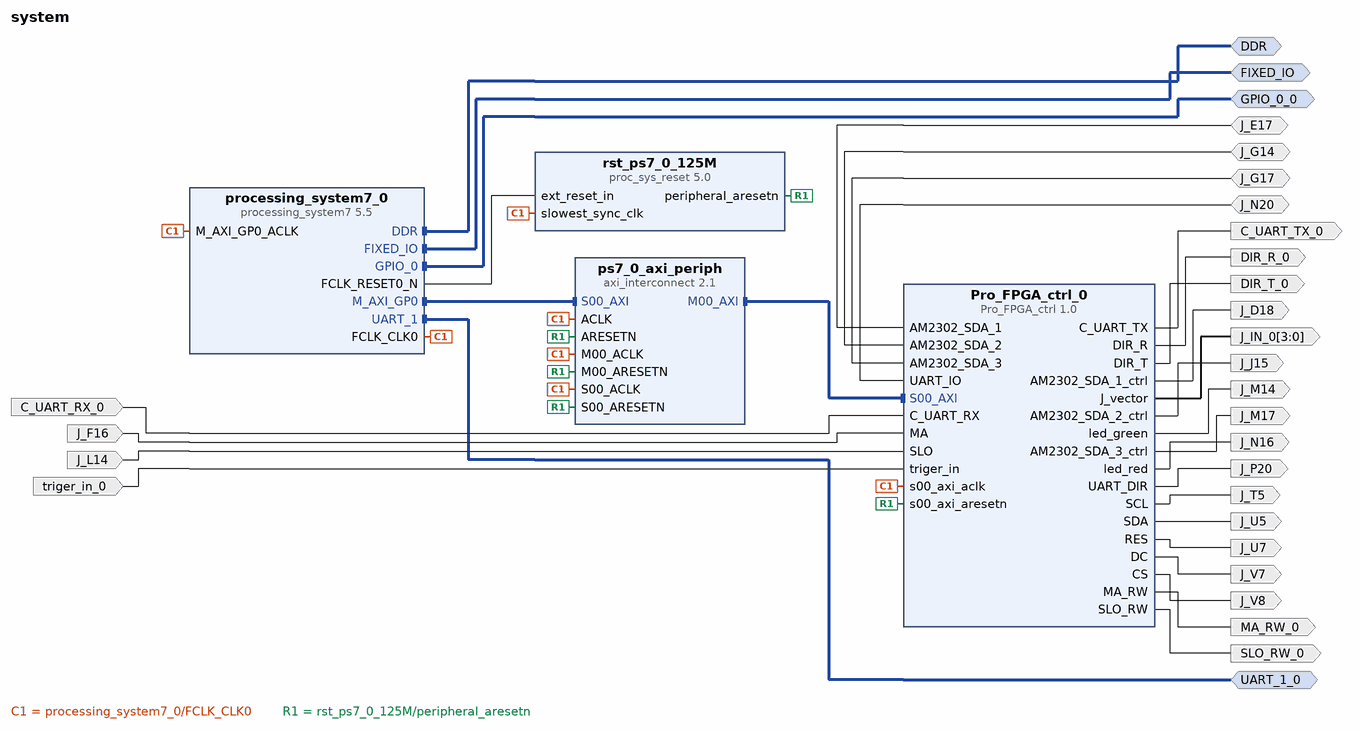
[diagram p0: block diagram of the top level]
# Vivado block design system, xc7z020clg400-2, Vivado 2018.3
create_bd_design system

create_bd_intf_port -mode Master -vlnv xilinx.com:interface:ddrx_rtl:1.0 DDR
create_bd_intf_port -mode Master -vlnv xilinx.com:display_processing_system7:fixedio_rtl:1.0 FIXED_IO
create_bd_intf_port -mode Master -vlnv xilinx.com:interface:uart_rtl:1.0 UART_1_0
create_bd_intf_port -mode Master -vlnv xilinx.com:interface:gpio_rtl:1.0 GPIO_0_0
create_bd_port -dir IO J_E17
create_bd_port -dir O J_D18
create_bd_port -dir IO J_G14
create_bd_port -dir O J_J15
create_bd_port -dir IO J_G17
create_bd_port -dir O J_M17
create_bd_port -dir O J_V8
create_bd_port -dir I C_UART_RX_0
create_bd_port -dir O C_UART_TX_0
create_bd_port -dir O J_V7
create_bd_port -dir O DIR_R_0
create_bd_port -dir O DIR_T_0
create_bd_port -dir O -from 3 -to 0 J_IN_0
create_bd_port -dir I J_F16
create_bd_port -dir O MA_RW_0
create_bd_port -dir O J_U7
create_bd_port -dir O J_T5
create_bd_port -dir O J_U5
create_bd_port -dir I J_L14
create_bd_port -dir O SLO_RW_0
create_bd_port -dir O J_P20
create_bd_port -dir IO J_N20
create_bd_port -dir O J_M14
create_bd_port -dir O J_N16
create_bd_port -dir I triger_in_0

create_bd_cell -type ip -vlnv xilinx.com:ip:processing_system7:5.5 processing_system7_0
set_property -dict [list \
  CONFIG.PCW_APU_PERIPHERAL_FREQMHZ 666.666666 \
  CONFIG.PCW_CPU_CPU_6X4X_MAX_RANGE 767 \
  CONFIG.PCW_ENET0_ENET0_IO {MIO 16 .. 27} \
  CONFIG.PCW_ENET0_GRP_MDIO_ENABLE 1 \
  CONFIG.PCW_ENET0_GRP_MDIO_IO {MIO 52 .. 53} \
  CONFIG.PCW_ENET0_PERIPHERAL_ENABLE 1 \
  CONFIG.PCW_FCLK_CLK0_BUF FALSE \
  CONFIG.PCW_FPGA0_PERIPHERAL_FREQMHZ 125 \
  CONFIG.PCW_FPGA1_PERIPHERAL_FREQMHZ 125 \
  CONFIG.PCW_GPIO_EMIO_GPIO_ENABLE 1 \
  CONFIG.PCW_GPIO_EMIO_GPIO_IO 1 \
  CONFIG.PCW_GPIO_EMIO_GPIO_WIDTH 1 \
  CONFIG.PCW_GPIO_MIO_GPIO_ENABLE 0 \
  CONFIG.PCW_PERIPHERAL_BOARD_PRESET None \
  CONFIG.PCW_PRESET_BANK1_VOLTAGE {LVCMOS 1.8V} \
  CONFIG.PCW_QSPI_GRP_SINGLE_SS_ENABLE 1 \
  CONFIG.PCW_QSPI_GRP_SINGLE_SS_IO {MIO 1 .. 6} \
  CONFIG.PCW_QSPI_PERIPHERAL_ENABLE 1 \
  CONFIG.PCW_QSPI_QSPI_IO {MIO 1 .. 6} \
  CONFIG.PCW_SD0_GRP_CD_ENABLE 0 \
  CONFIG.PCW_SD0_GRP_WP_ENABLE 0 \
  CONFIG.PCW_SD0_PERIPHERAL_ENABLE 1 \
  CONFIG.PCW_SD0_SD0_IO {MIO 40 .. 45} \
  CONFIG.PCW_SDIO_PERIPHERAL_FREQMHZ 100 \
  CONFIG.PCW_SINGLE_QSPI_DATA_MODE x4 \
  CONFIG.PCW_TTC0_PERIPHERAL_ENABLE 1 \
  CONFIG.PCW_TTC0_TTC0_IO EMIO \
  CONFIG.PCW_UART0_PERIPHERAL_ENABLE 1 \
  CONFIG.PCW_UART0_UART0_IO {MIO 14 .. 15} \
  CONFIG.PCW_UART1_PERIPHERAL_ENABLE 1 \
  CONFIG.PCW_UART1_UART1_IO EMIO \
  CONFIG.PCW_UART_PERIPHERAL_FREQMHZ 100 \
  CONFIG.PCW_UIPARAM_DDR_FREQ_MHZ 533.333333 \
  CONFIG.PCW_UIPARAM_DDR_MEMORY_TYPE {DDR 3 (Low Voltage)} \
  CONFIG.PCW_UIPARAM_DDR_PARTNO {MT41K256M16 RE-125} \
  CONFIG.PCW_USB0_PERIPHERAL_ENABLE 0 \
  CONFIG.PCW_USE_FABRIC_INTERRUPT 1 \
] [get_bd_cells processing_system7_0]
# 434 more settings of processing_system7_0 are not shown: defaults, MIO pin electricals, DDR timing, and values the tool derives
create_bd_cell -type ip -vlnv xilinx.com:ip:axi_interconnect:2.1 ps7_0_axi_periph
set_property -dict {CONFIG.NUM_MI 1} [get_bd_cells ps7_0_axi_periph]
create_bd_cell -type ip -vlnv xilinx.com:ip:proc_sys_reset:5.0 rst_ps7_0_125M
create_bd_cell -type ip -vlnv xilinx.com:user:Pro_FPGA_ctrl:1.0 Pro_FPGA_ctrl_0

# ---- connections ----

connect_bd_intf_net [get_bd_intf_ports DDR] [get_bd_intf_pins processing_system7_0/DDR]
connect_bd_intf_net [get_bd_intf_ports GPIO_0_0] [get_bd_intf_pins processing_system7_0/GPIO_0]
connect_bd_intf_net [get_bd_intf_ports FIXED_IO] [get_bd_intf_pins processing_system7_0/FIXED_IO]
connect_bd_intf_net [get_bd_intf_ports UART_1_0] [get_bd_intf_pins processing_system7_0/UART_1]
connect_bd_intf_net [get_bd_intf_pins processing_system7_0/M_AXI_GP0] [get_bd_intf_pins ps7_0_axi_periph/S00_AXI]
connect_bd_intf_net [get_bd_intf_pins ps7_0_axi_periph/M00_AXI] [get_bd_intf_pins Pro_FPGA_ctrl_0/S00_AXI]
connect_bd_net [get_bd_pins processing_system7_0/FCLK_CLK0] \
  [get_bd_pins processing_system7_0/M_AXI_GP0_ACLK] [get_bd_pins ps7_0_axi_periph/ACLK] \
  [get_bd_pins ps7_0_axi_periph/S00_ACLK] [get_bd_pins rst_ps7_0_125M/slowest_sync_clk] \
  [get_bd_pins ps7_0_axi_periph/M00_ACLK] [get_bd_pins Pro_FPGA_ctrl_0/s00_axi_aclk]
connect_bd_net [get_bd_pins processing_system7_0/FCLK_RESET0_N] [get_bd_pins rst_ps7_0_125M/ext_reset_in]
connect_bd_net [get_bd_pins rst_ps7_0_125M/peripheral_aresetn] \
  [get_bd_pins ps7_0_axi_periph/S00_ARESETN] [get_bd_pins ps7_0_axi_periph/M00_ARESETN] \
  [get_bd_pins ps7_0_axi_periph/ARESETN] [get_bd_pins Pro_FPGA_ctrl_0/s00_axi_aresetn]
connect_bd_net [get_bd_ports J_E17] [get_bd_pins Pro_FPGA_ctrl_0/AM2302_SDA_1]
connect_bd_net [get_bd_pins Pro_FPGA_ctrl_0/AM2302_SDA_1_ctrl] [get_bd_ports J_D18]
connect_bd_net [get_bd_ports J_G14] [get_bd_pins Pro_FPGA_ctrl_0/AM2302_SDA_2]
connect_bd_net [get_bd_pins Pro_FPGA_ctrl_0/AM2302_SDA_2_ctrl] [get_bd_ports J_J15]
connect_bd_net [get_bd_ports J_G17] [get_bd_pins Pro_FPGA_ctrl_0/AM2302_SDA_3]
connect_bd_net [get_bd_pins Pro_FPGA_ctrl_0/AM2302_SDA_3_ctrl] [get_bd_ports J_M17]
connect_bd_net [get_bd_pins Pro_FPGA_ctrl_0/CS] [get_bd_ports J_V8]
connect_bd_net -net C_UART_RX_0_1 [get_bd_ports C_UART_RX_0] [get_bd_pins Pro_FPGA_ctrl_0/C_UART_RX]
connect_bd_net [get_bd_pins Pro_FPGA_ctrl_0/C_UART_TX] [get_bd_ports C_UART_TX_0]
connect_bd_net [get_bd_pins Pro_FPGA_ctrl_0/DC] [get_bd_ports J_V7]
connect_bd_net [get_bd_pins Pro_FPGA_ctrl_0/DIR_R] [get_bd_ports DIR_R_0]
connect_bd_net [get_bd_pins Pro_FPGA_ctrl_0/DIR_T] [get_bd_ports DIR_T_0]
connect_bd_net [get_bd_pins Pro_FPGA_ctrl_0/J_vector] [get_bd_ports J_IN_0]
connect_bd_net -net MA_0_1 [get_bd_ports J_F16] [get_bd_pins Pro_FPGA_ctrl_0/MA]
connect_bd_net [get_bd_pins Pro_FPGA_ctrl_0/MA_RW] [get_bd_ports MA_RW_0]
connect_bd_net [get_bd_pins Pro_FPGA_ctrl_0/RES] [get_bd_ports J_U7]
connect_bd_net [get_bd_pins Pro_FPGA_ctrl_0/SCL] [get_bd_ports J_T5]
connect_bd_net [get_bd_pins Pro_FPGA_ctrl_0/SDA] [get_bd_ports J_U5]
connect_bd_net -net SLO_0_1 [get_bd_ports J_L14] [get_bd_pins Pro_FPGA_ctrl_0/SLO]
connect_bd_net [get_bd_pins Pro_FPGA_ctrl_0/SLO_RW] [get_bd_ports SLO_RW_0]
connect_bd_net [get_bd_pins Pro_FPGA_ctrl_0/UART_DIR] [get_bd_ports J_P20]
connect_bd_net [get_bd_ports J_N20] [get_bd_pins Pro_FPGA_ctrl_0/UART_IO]
connect_bd_net [get_bd_pins Pro_FPGA_ctrl_0/led_green] [get_bd_ports J_M14]
connect_bd_net [get_bd_pins Pro_FPGA_ctrl_0/led_red] [get_bd_ports J_N16]
connect_bd_net -net triger_in_0_1 [get_bd_ports triger_in_0] [get_bd_pins Pro_FPGA_ctrl_0/triger_in]
set_property HDL_ATTRIBUTE.BMM_INFO_PROCESSOR {arm > system axi_bram_ctrl_0} [get_bd_cells processing_system7_0]
set_property HDL_ATTRIBUTE.KEEP_HIERARCHY yes [get_bd_cells processing_system7_0]

# ---- address map ----
assign_bd_address -offset 0x43C00000 -range 64K -target_address_space [get_bd_addr_spaces processing_system7_0/Data] [get_bd_addr_segs Pro_FPGA_ctrl_0/S00_AXI/S00_AXI_reg]

validate_bd_design
save_bd_design
